# Altium schematic sheet Power_Supply.SchDoc: Carte Découpe DMX
size A4
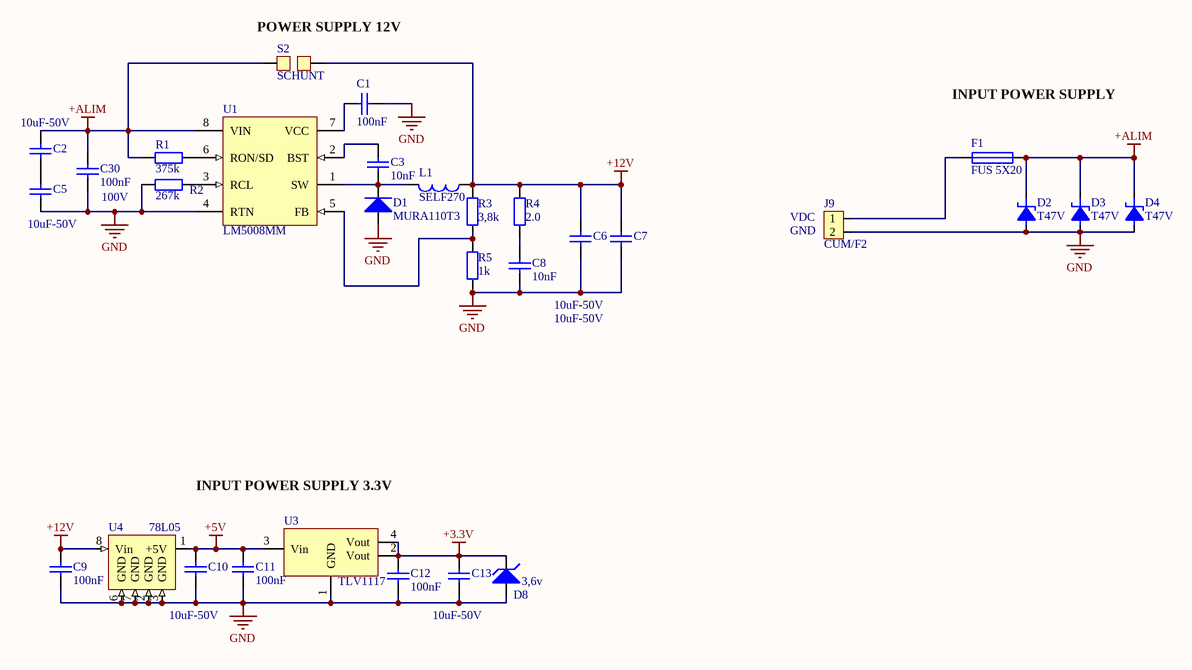
[diagram p0: Power_Supply.SchDoc]

## Parts
C1  100nF  [C0603]
C2  10uF-50V  [C1206]
C3  10nF  [C0603]
C5  10uF-50V  [C1206]
C6  10uF-50V  [C1206]
C7  10uF-50V  [C1206]
C8  10nF  [C0603]
C9  100nF  [C0603]
C10  10uF-50V  [C1206]
C11  100nF  [C0603]
C12  100nF  [C0603]
C13  10uF-50V  [C1206]
C30  100nF  [C0603]
D1  MURA110T3  [DO-214AC]
D2  T47V  [DIO47A]
D3  T47V  [DIO47A]
D4  T47V  [DIO47A]
D8  3,6v  [SOD123]
F1  FUS 5X20  [FUSPO-A1]
J9  CUM/F2  [CNT2H]
L1  SELF270  [SELF270]
R1  375k  [R0603]
R2  267k  [R0603]
R3  3,8k  [R0603]
R4  2.0  [R0603]
R5  1k  [R0603]
S2  SCHUNT  [SCHUNT]
U1  LM5008MM  [MUA08A_M]
U3  TLV1117  [SOT223]
U4  78L05  [REG5VE]

## Nets
+3.3V: C12.1 C13.2 D8.2(K) U3.2(Vout) U3.4(Vout)
+5V: C10.2 C11.1 U3.3(Vin) U4.1(+5V)
+12V: C6.2 C7.2 C9.1 L1.2 R3.1 R4.1 S2.1 U4.8(Vin)
+ALIM: C2.2 C30.1 D2.1 D3.1 D4.1 F1.2 R1.2 S2.2 U1.8(VIN)
GND: C1.1 C5.1 C6.1 C7.1 C8.1 C9.2 C10.1 C11.2 C12.2 C13.1 C30.2 D1.1(A) D2.2 D3.2 D4.2 D8.1(A) J9.2 R2.2 R5.2 U1.4(RTN) U3.1(GND) U4.2(GND) U4.3(GND) U4.6(GND) U4.7(GND)
NetC1_2: C1.2 U1.7(VCC)
NetC2_1: C2.1 C5.2
NetC3_1: C3.1 D1.2(K) L1.1 U1.1(SW)
NetC3_2: C3.2 U1.2(BST)
NetC8_2: C8.2 R4.2
NetF1_1: F1.1 J9.1
NetR1_1: R1.1 U1.6(RON/SD)
NetR2_1: R2.1 U1.3(RCL)
NetR3_2: R3.2 R5.1 U1.5(FB)

## Notes on the sheet
- (near S2) POWER SUPPLY 12V
- INPUT POWER SUPPLY
- 100V
- (near J9) VDC
- (near J9) GND
- INPUT POWER SUPPLY 3.3V
- Title
- Size:
- Date:
- A4
- Number:
- Time:
- Revision:
- Sheet
- of
- File:

## Library data of the parts
C1-C3 C5-C13 C30 = Cap: Capacitor
  C1 C9 C11 C12 C30: Value: 100nF
  C2 C5-C7 C10 C13: Value: 10uF-50V
  C3 C8: Value: 10nF
D1 = Diode: Ref_Fabricant: MURA110T3
D2-D4 = T47V: TRANSIL CMS 47V unidirectionnelle
D8 = D Zener: Zener Diode; Value: 3,6v
F1 = FUS 5X20: FUSIBLE VERRE 5 x 20
J9 = CUM/F2: connecteur  2 points
L1 = SELF270: self 270uH
R1 R3-R5 = Res: Thin Metal Film Resistor
  R1: Value: 375k
  R3: Value: 3,8k
  R4: Value: 2.0
  R5: Value: 1k
R2 = Res: Thin Metal Film Resistor; Value: 375k
S2 = SCHUNT: schunt 2 points
U1 = LM5008MM: High Voltage (100V) Step Down Switching Regulator, 8-pin MSOP; Manufacturer: National Semiconductor; PackageTopMarking: ZXTT*SAYB; PowerWise: N; CompType: Switcher; ComponentLink1Description: LM5008 Datasheet; ComponentLink2Description: LM5008 Web Page; DatasheetVersion: Apr-2009; ComponentLink3Description: MUA08A Package Page; PinCount: 8; ComponentLink1URL: http://www.national.com/ds/LM/LM5008.pdf; ComponentLink2URL: http://www.national.com/pf/LM/LM5008.html; Code_JEDEC: MO-187-AA; RevisionNote: Component URLs added; ComponentLink3URL: http://www.national.com/packaging/folders/mua08a.html; PackageVersion: revF, Apr-2008; PackageDescription: MINI SOIC, .118 x .118 x .034in, 8 Lead, .0256in Pitch; RoHS: N; PackageReference: MUA08A; PartNumber: LM5008MM
U3 = TLV1117: LDO regulator 3.3V; Fabricant: Texas; Fournisseur: Farnell; Ref_Fournisseur: 1703385; Prix: 0.75; Ref_Fabricant: TLV1117
U4 = 78L05: E:cms ;C1:faible conso; VD:TO220 debout;